# EAGLE schematic 4988cape-V1.0 (EAGLE 7.2.0)
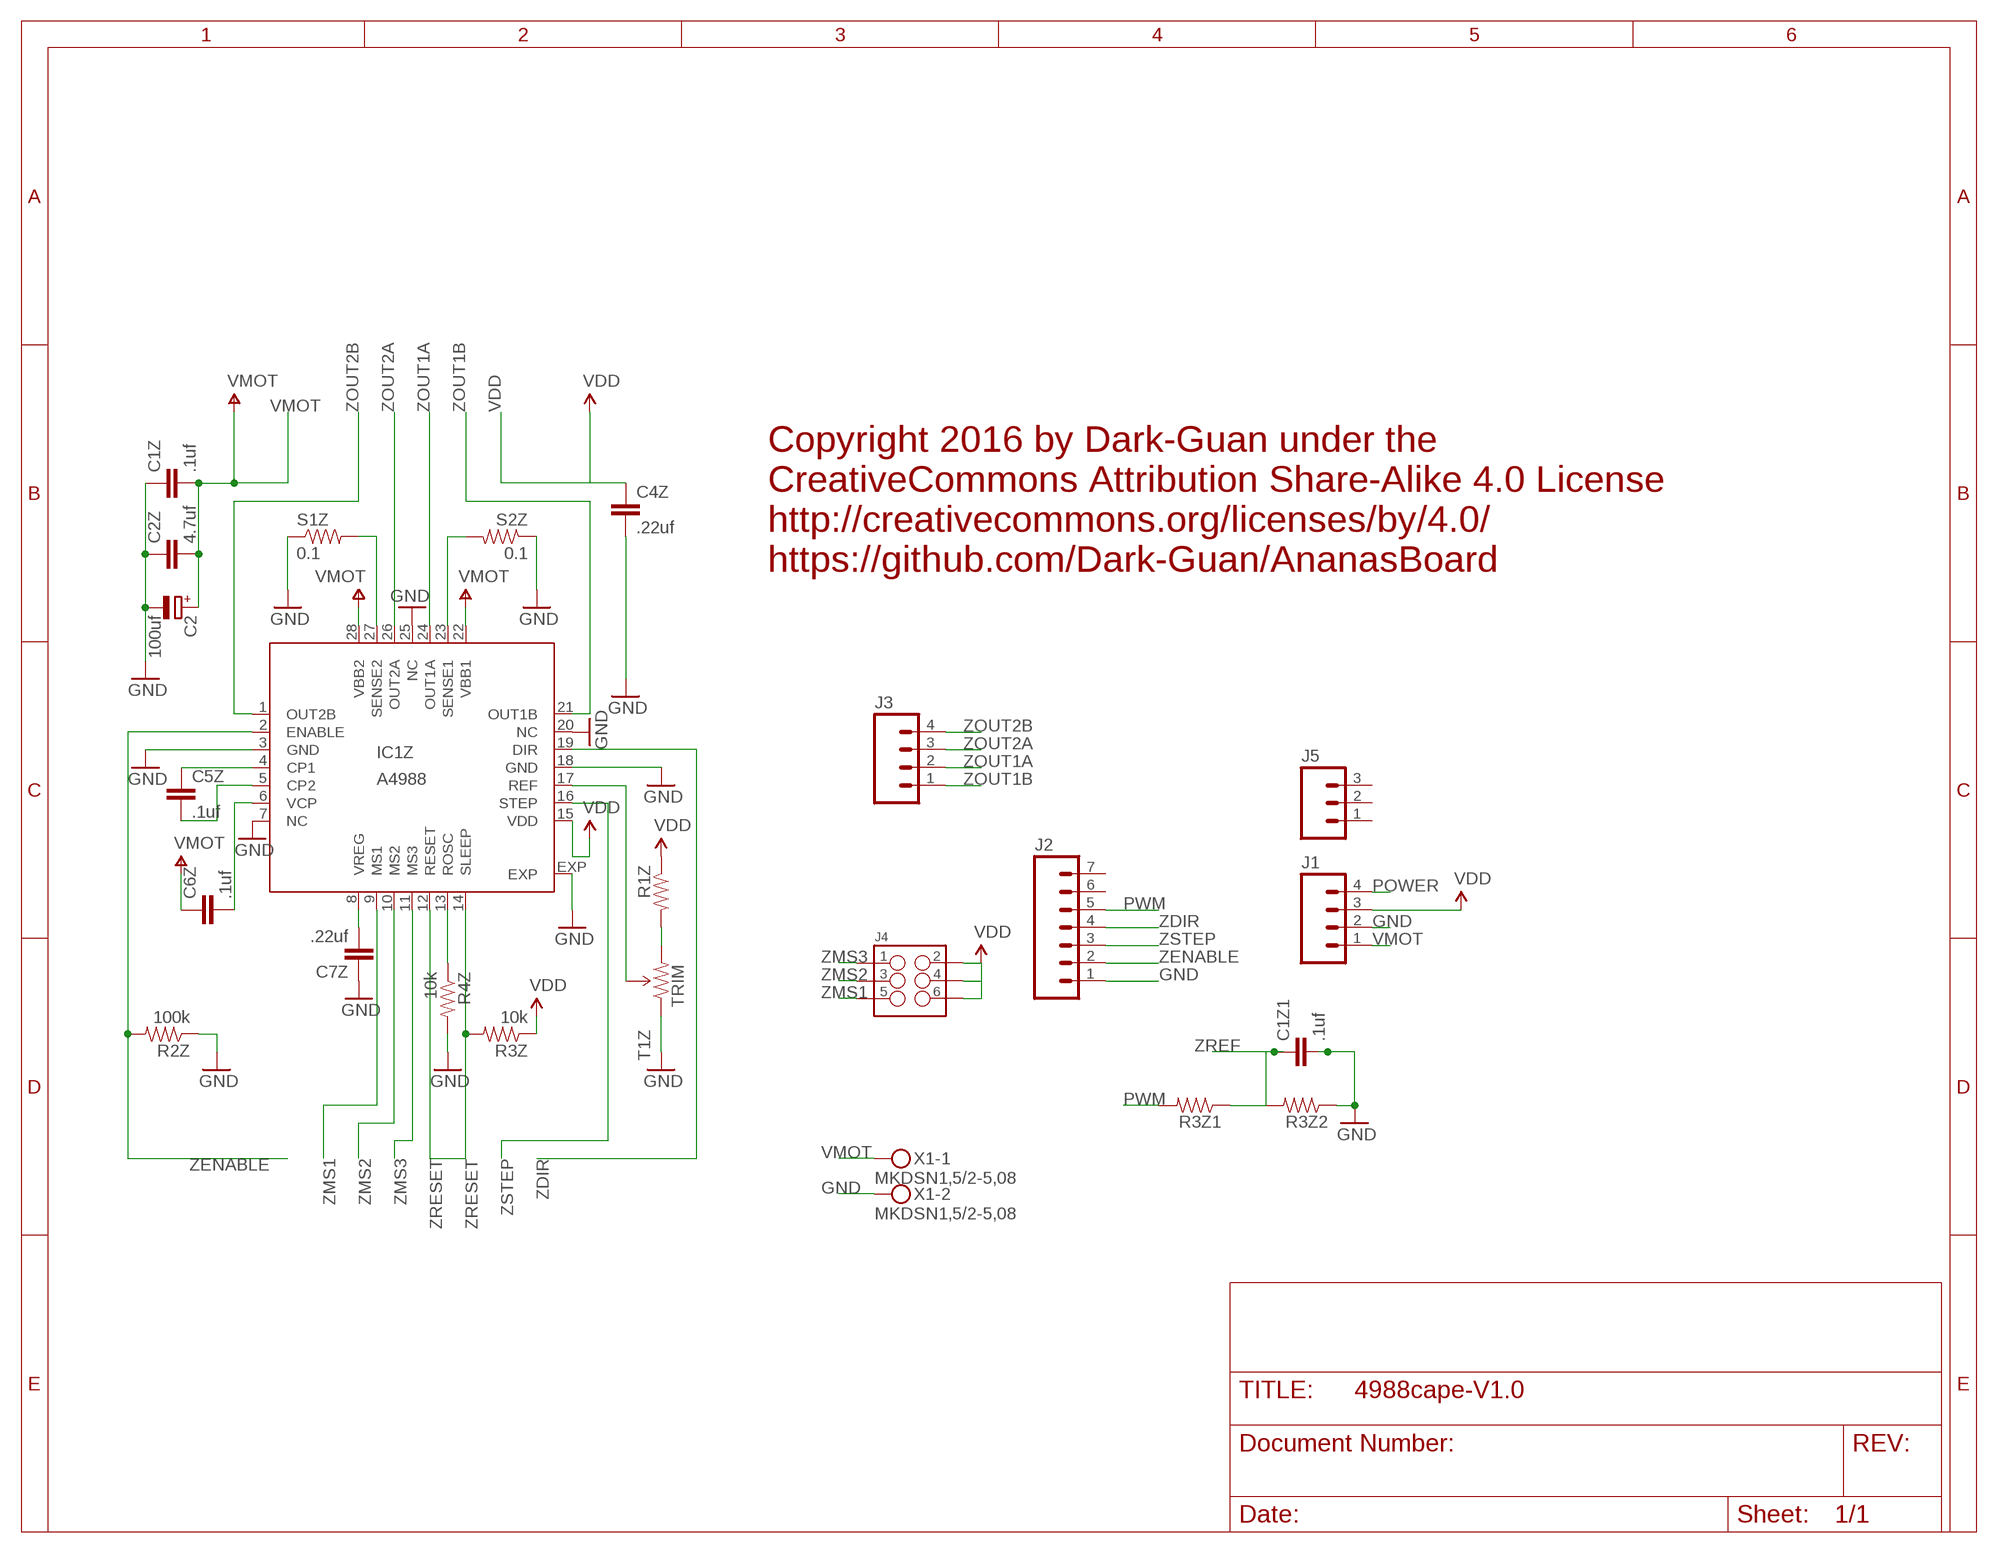
[diagram p0: schematic, sheet 1]

## Parts
C1Z  .1uf  CAP0402-CAP  [0402-CAP]
C1Z1  .1uf  CAP0402-CAP  [0402-CAP]
C2  100uf  CPOL-EU153CLV-0605  [153CLV-0605]
C2Z  4.7uf  CAP0402-CAP  [0402-CAP]
C4Z  .22uf  CAP0402-CAP  [0402-CAP]
C5Z  .1uf  CAP0402-CAP  [0402-CAP]
C6Z  .1uf  CAP0402-CAP  [0402-CAP]
C7Z  .22uf  CAP0402-CAP  [0402-CAP]
IC1Z  A4988  A4983  [QFN28ET]
J1  M04PTH  [1X04]
J2  M07  [1X07]
J3  M04PTH  [1X04]
J4  M03X2NO_SILK  [2X3-NS]
J5  M03PTH  [1X03]
R1Z  RESISTOR0402-RES  [0402-RES]
R2Z  100k  RESISTOR0402-RES  [0402-RES]
R3Z  10k  RESISTOR0402-RES  [0402-RES]
R3Z1  RESISTOR0402-RES  [0402-RES]
R3Z2  RESISTOR0402-RES  [0402-RES]
R4Z  10k  RESISTOR0402-RES  [0402-RES]
S1Z  0.1  RESISTOR  [0805]
S2Z  0.1  RESISTOR  [0805]
T1Z  TRIM  TRIMPOTSMD  [TRIMPOT-3MM]
X1  MKDSN1,5/2-5,08  [MKDSN1,5/2-5,08]

## Nets
GND: C1Z1.2 C1Z.1 C2.- C2Z.1 C4Z.2 C7Z.1 IC1Z.3(GND) IC1Z.7(NC) IC1Z.18(GND) IC1Z.20(NC) IC1Z.25(NC) IC1Z.EXP J1.2 J2.1 R2Z.1 R3Z2.1 R4Z.2 S1Z.1 S2Z.1 T1Z.1(CCW) X1.2
POWER: J1.4
PWM: J2.5 R3Z1.2
VDD: C4Z.1 IC1Z.15(VDD) J1.3 J4.2 J4.4 J4.6 R1Z.1 R3Z.1
VMOT: C1Z.2 C2.+ C2Z.2 C6Z.1 IC1Z.22(VBB1) IC1Z.28(VBB2) J1.1 X1.1
ZCP1: C5Z.1 IC1Z.4(CP1)
ZCP2: C5Z.2 IC1Z.5(CP2)
ZDIR: IC1Z.19(DIR) J2.4
ZENABLE: IC1Z.2(ENABLE) J2.2 R2Z.2
ZMS1: IC1Z.9(MS1) J4.5
ZMS2: IC1Z.10(MS2) J4.3
ZMS3: IC1Z.11(MS3) J4.1
ZOUT1A: IC1Z.24(OUT1A) J3.2
ZOUT1B: IC1Z.21(OUT1B) J3.1
ZOUT2A: IC1Z.26(OUT2A) J3.3
ZOUT2B: IC1Z.1(OUT2B) J3.4
ZREF: C1Z1.1 IC1Z.17(REF) R3Z1.1 R3Z2.2 T1Z.2(WIPER)
ZREF2: R1Z.2 T1Z.3(CW)
ZRESET: IC1Z.12(RESET) IC1Z.14(SLEEP) R3Z.2
ZROSC: IC1Z.13(ROSC) R4Z.1
ZSENSE1: IC1Z.23(SENSE1) S2Z.2
ZSENSE2: IC1Z.27(SENSE2) S1Z.2
ZSTEP: IC1Z.16(STEP) J2.3
ZVCP: C6Z.2 IC1Z.6(VCP)
ZVREG: C7Z.2 IC1Z.8(VREG)
Unconnected: J2.6 J2.7 J5.1 J5.2 J5.3

## Notes on the sheet
- Copyright 2016 by Dark-Guan under the
  CreativeCommons Attribution Share-Alike 4.0 License
  http://creativecommons.org/licenses/by/4.0/
  https://github.com/Dark-Guan/AnanasBoard

## Library data of the parts
C1Z C1Z1 C2Z C4Z C5Z C6Z C7Z = SparkFun:CAP: Capacitor Standard 0603 ceramic capacitor, and 0.1" leaded capacitor.
C2 = arduino_Uno_Rev3-02-TH:CPOL-EU: POLARIZED CAPACITOR, European symbol
IC1Z = allegro:A4983: DMOS Microstepping Driver with Translator Auto generated by make-symbol-device-package-bsdl.ulp Rev. 32 Source: http://www.allegromicro.com/en/Products/Part_Numbers/4983/4983.pdf
J1 J3 = SparkFun-Connectors:M04: Header 4 Standard 4-pin 0.1" header. Use with straight break away headers (SKU : PRT-00116), right angle break away headers (PRT-00553), swiss pins (PRT-00743), machine pins (PRT-00117), and female headers (PRT-00115). Molex polarized connector foot print use with SKU : PRT-08231 with associated crimp pins and housings. 1MM SMD Version SKU: PRT-10208; PROD_ID: CONN-09696
J2 = SparkFun-Connectors:M07: Header 7 Standard 7-pin 0.1" header. Use with straight break away headers (SKU : PRT-00116), right angle break away headers (PRT-00553), swiss pins (PRT-00743), machine pins (PRT-00117), and female headers (PRT-00115). NOTES ON THE VARIANTS LOCK and LOCK_LONGPADS... This footprint was designed to help hold the alignment of a through-hole component (i.e. 7-pin header) while soldering it into place. You may notice that each hole has been shifted either up or down by 0.005 of an inch from it's more standard position (which is usually a perfectly straight line). This slight alteration caused the pins (the squares in the middle) to touch the edges of the holes. Because they are alternating, it causes a "brace" to hold the header in place. 0.005 has proven to be the perfect amount of "off-center" position when using our standard breakaway headers. Although looks a little odd when you look at the bare footprint, once you have a header in there, the alteration is very hard to notice. Also, if you push a header all the way into place, it is covered up entirely on the bottom side. This idea of altering the position of holes to aid alignment will be further integrated into the Sparkfun Library for other footprints. It can help hold any component with 3 or more connection pins.
J4 = SparkFun-Connectors:M03X2: 2x3 .1" header. Shrouded, with keying- CONN-10681 SMT- CONN-11415 Pogo pins- HW-11044
J5 = SparkFun-Connectors:M03: Header 3 Standard 3-pin 0.1" header. Use with straight break away headers (SKU : PRT-00116), right angle break away headers (PRT-00553), swiss pins (PRT-00743), machine pins (PRT-00117), and female headers (PRT-00115). Molex polarized connector foot print use with SKU : PRT-08232 with associated crimp pins and housings.
R1Z R2Z R3Z R3Z1 R3Z2 R4Z S1Z S2Z = SparkFun:RESISTOR: Resistor Basic schematic elements and footprints for 0603, 1206, and PTH 1/10th watt (small) resistors.
T1Z = SparkFun:TRIMPOT
X1 = con-phoenix-508:MKDSN1,5/2-5,08: MKDSN 1,5/ 2-5,08 Printklemme Nennstrom: 13,5 A Nennspannung: 250 V Rastermaß: 5,08 mm Polzahl: 2 Anschlussart: Schraubanschluss Montage: Löten Anschlussrichtung Leiter/Platine: 0 ° Artikelnummer: 1729128 Source: http://eshop.phoenixcontact.com .. 1729128.pdf